# EAGLE schematic circuit1 (EAGLE 6.6.0)
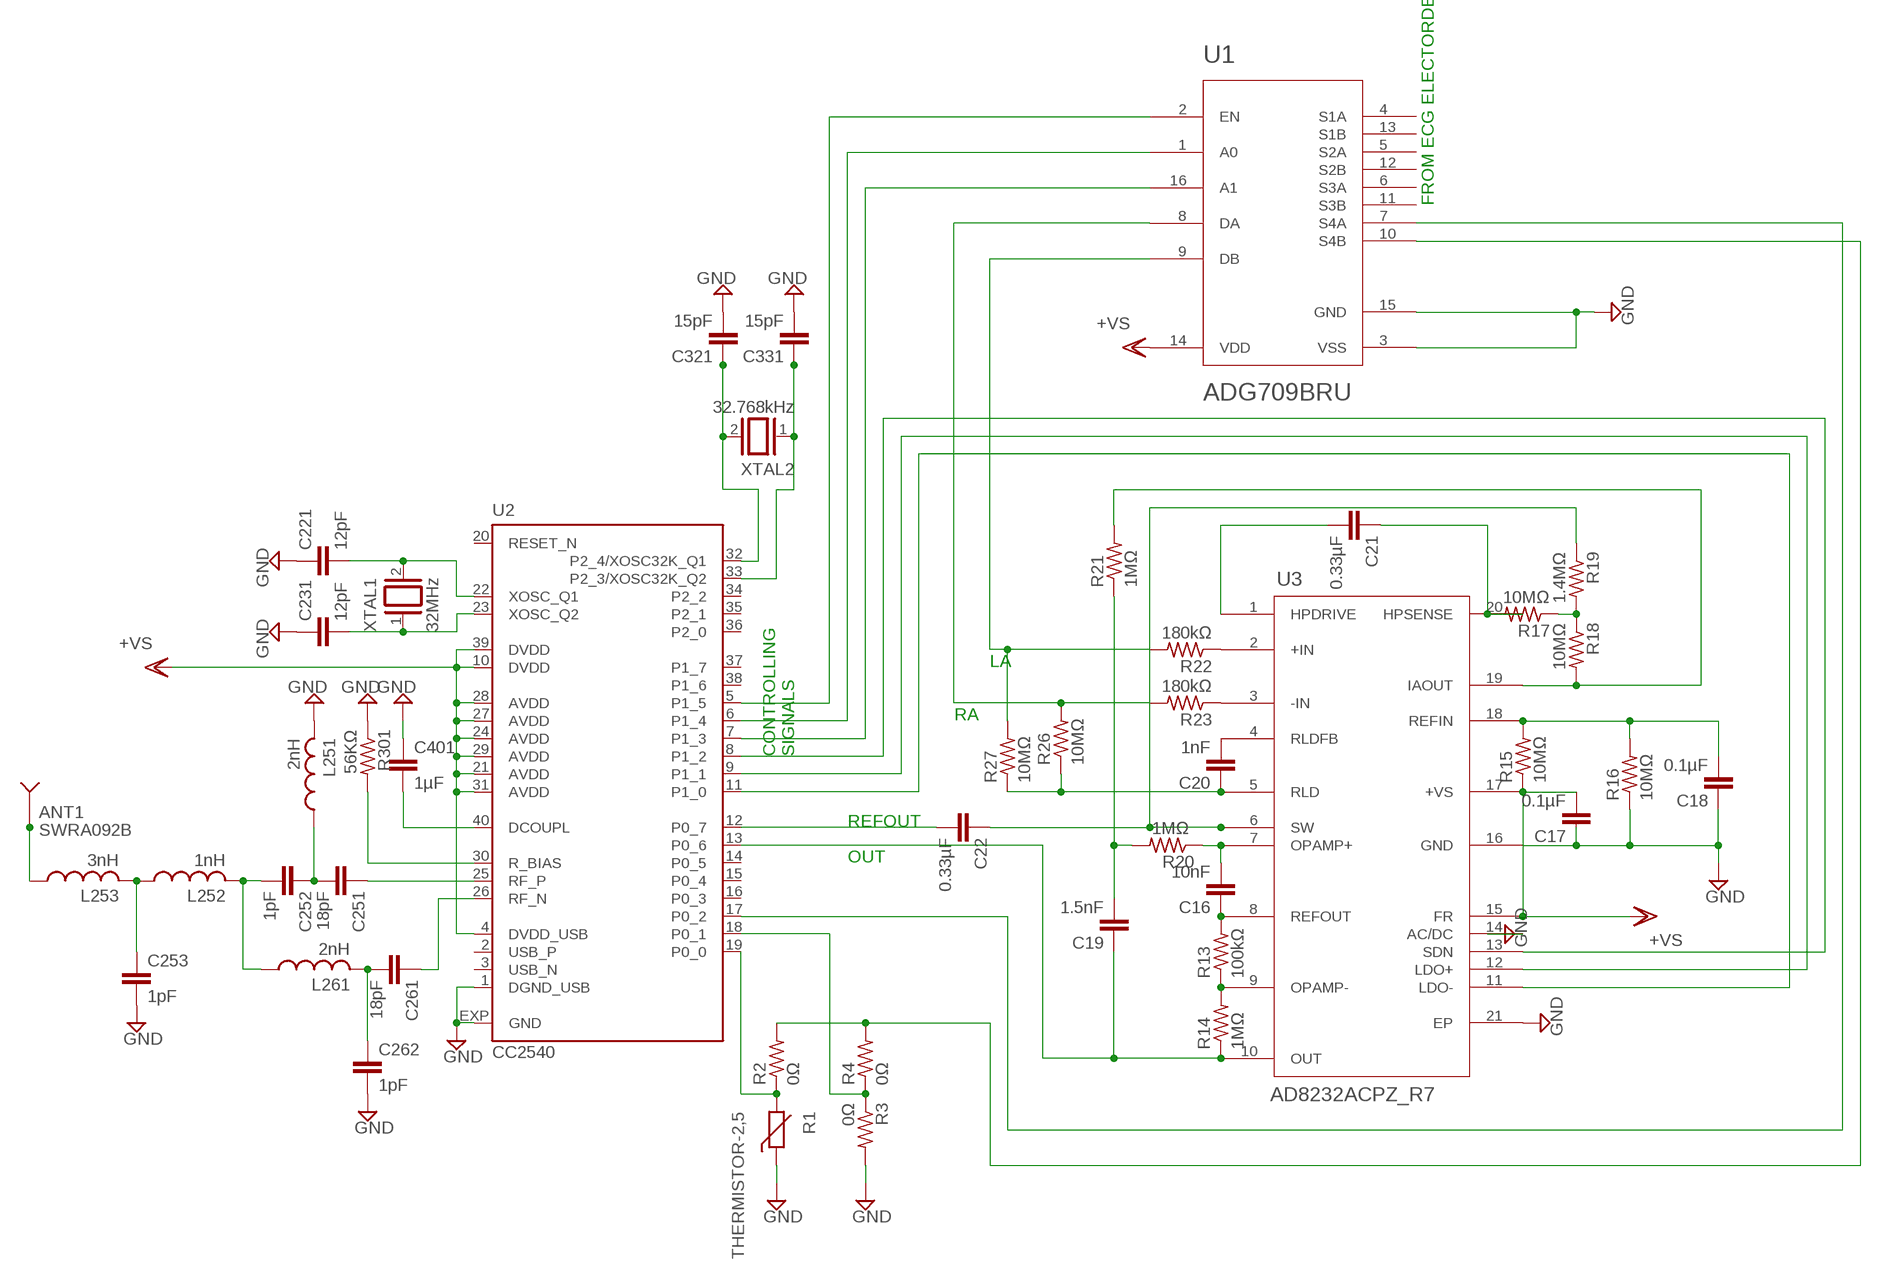
[diagram p0: schematic, sheet 1]

## Parts
ANT1  SWRA092B  [SWRA092B]
C16  10nF  C-EUC0402  [C0402]
C17  0.1µF  C-EUC0402  [C0402]
C18  0.1µF  C-EUC0402  [C0402]
C19  1.5nF  C-EUC0402  [C0402]
C20  1nF  C-EUC0402  [C0402]
C21  0.33µF  C-EUC0402  [C0402]
C22  0.33µF  C-EUC0402  [C0402]
C221  12pF  C-EUC0402  [C0402]
C231  12pF  C-EUC0402  [C0402]
C251  18pF  C-EUC0402  [C0402]
C252  1pF  C-EUC0402  [C0402]
C253  1pF  C-EUC0402  [C0402]
C261  18pF  C-EUC0402  [C0402]
C262  1pF  C-EUC0402  [C0402]
C321  15pF  C-EUC0402  [C0402]
C331  15pF  C-EUC0402  [C0402]
C401  1µF  C-EUC0402  [C0402]
L251  2nH  L-US0204/5  [0204/5]
L252  1nH  L-US0204/5  [0204/5]
L253  3nH  L-US0204/5  [0204/5]
L261  2nH  L-US0204/5  [0204/5]
R1  THERMISTOR-2,5  [RS-2,5]
R2  0Ω  R-US_R0402  [R0402]
R3  0Ω  R-US_R0402  [R0402]
R4  0Ω  R-US_R0402  [R0402]
R13  100kΩ  R-US_R0402  [R0402]
R14  1MΩ  R-US_R0402  [R0402]
R15  10MΩ  R-US_R0402  [R0402]
R16  10MΩ  R-US_R0402  [R0402]
R17  10MΩ  R-US_R0402  [R0402]
R18  10MΩ  R-US_R0402  [R0402]
R19  1.4MΩ  R-US_R0402  [R0402]
R20  1MΩ  R-US_R0402  [R0402]
R21  1MΩ  R-US_R0402  [R0402]
R22  180kΩ  R-US_R0402  [R0402]
R23  180kΩ  R-US_R0402  [R0402]
R26  10MΩ  R-US_R0402  [R0402]
R27  10MΩ  R-US_R0402  [R0402]
R301  56KΩ  R-US_R0402  [R0402]
U1  ADG709BRU  [RU_16]
U2  CC2540  [RHA_S-PVQFN-N40]
U3  AD8232ACPZ_R7  [CP_20_10]
XTAL1  32MHz  XTAL  [Q]
XTAL2  32.768kHz  XTAL  [Q]

## Nets
GND: C17.1 C18.1 C221.1 C231.1 C253.2 C262.2 C321.2 C331.2 C401.1 L251.2 R1.1 R3.2 R16.1 R301.1 U1.3(VSS) U1.15(GND) U2.1(DGND_USB) U2.EXP(GND) U3.14(AC/DC) U3.16(GND) U3.21(EP)
N$1: C251.1 U2.25(RF_P)
N$2: R301.2 U2.30(R_BIAS)
N$3: C251.2 C252.1 L251.1
N$4: C261.2 C262.1 L261.2
N$5: C252.2 L252.2 L261.1
N$6: C253.1 L252.1 L253.2
N$7: ANT1.1(ANTENNA) L253.1
N$8: C401.2 U2.40(DCOUPL)
N$9: U1.2(EN) U2.5(P1_5)
N$10: R1.2 R2.1 U2.19(P0_0)
N$11: C221.2 U2.22(XOSC_Q1) XTAL1.2
N$12: C231.2 U2.23(XOSC_Q2) XTAL1.1
N$13: C321.1 U2.32(P2_4/XOSC32K_Q1) XTAL2.2
N$14: C331.1 U2.33(P2_3/XOSC32K_Q2) XTAL2.1
N$15: R22.1 U3.2(+IN)
N$16: C261.1 U2.26(RF_N)
N$17: C20.1 R26.1 R27.1 U3.5(RLD)
N$18: C22.2 U2.12(P0_7)
N$19: U1.1(A0) U2.6(P1_4)
N$20: U1.16(A1) U2.7(P1_3)
N$21: R23.1 U3.3(-IN)
N$22: C22.1 R19.1 U3.6(SW)
N$24: R3.1 R4.1 U2.18(P0_1)
N$25: U2.11(P1_0) U3.11(LDO-)
N$26: U2.9(P1_1) U3.12(LDO+)
N$27: U2.8(P1_2) U3.13(SDN)
N$29: C19.2 R20.2 R21.1
N$31: R2.2 R4.2 U1.10(S4B)
N$32: U1.7(S4A) U2.17(P0_2)
N$37: R13.1 R14.2 U3.9(OPAMP-)
N$39: R22.2 R27.2 U1.9(DB)
N$40: R23.2 R26.2 U1.8(DA)
N$41: C16.2 R20.1 U3.7(OPAMP+)
N$42: C16.1 R13.2 U3.8(REFOUT)
N$43: C19.1 R14.1 U2.13(P0_6) U3.10(OUT)
N$46: C18.2 R15.2 R16.2 U3.18(REFIN)
N$49: R18.2 R21.2 U3.19(IAOUT)
N$50: C21.1 R17.2 U3.20(HPSENSE)
N$51: R17.1 R18.1 R19.2
N$54: C20.2 U3.4(RLDFB)
N$57: C21.2 U3.1(HPDRIVE)
VSS: C17.2 R15.1 U1.14(VDD) U2.4(DVDD_USB) U2.10(DVDD) U2.21(AVDD) U2.24(AVDD) U2.27(AVDD) U2.28(AVDD) U2.29(AVDD) U2.31(AVDD) U2.39(DVDD) U3.15(FR) U3.17(+VS) ; supply symbol labelled +VS
Unconnected: U1.4(S1A) U1.5(S2A) U1.6(S3A) U1.11(S3B) U1.12(S2B) U1.13(S1B) U2.2(USB_P) U2.3(USB_N) U2.14(P0_5) U2.15(P0_4) U2.16(P0_3) U2.20(RESET_N) U2.34(P2_2) U2.35(P2_1) U2.36(P2_0) U2.37(P1_7) U2.38(P1_6)

## Notes on the sheet
- FROM ECG ELECTORDES
- LA
- RA
- CONTROLLING
  SIGNALS
- REFOUT
- OUT

## Library data of the parts
ANT1 = texas:SWRA092B: Compact Reach XtendTM Bluetooth®, 802.11b/g WLAN Chip Antenna Source: Data sheet <http://www.ti.com/lit/an/swra092b/swra092b.pdf>
C16-C22 C221 C231 C251-C253 C261 C262 C321 C331 C401 = rcl:C-EU: CAPACITOR, European symbol
L251-L253 L261 = rcl:L-US: INDUCTOR, American symbol
R1 = varistor:THERMISTOR: THERMISTOR
R2-R4 R13-R23 R26 R27 R301 = rcl:R-US_: RESISTOR, American symbol
U1 = ADG709:ADG709BRU
U2 = ST-CC254X:CC2540: CC2540 Bluetooth Smart SoC
U3 = AD8232:AD8232ACPZ_R7
XTAL1 XTAL2 = special:XTAL: CRYSTAL